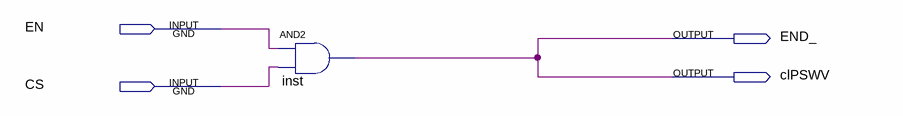
[diagram p0: schematic sheet]
// Quartus schematic CLV.bdf as structural Verilog: 1 symbols, 4 pins
module CLV (
  input  EN,
  input  CS,
  output END_,
  output clPSWV
);

  and inst (clPSWV, EN, CS);

  assign END_ = clPSWV;
endmodule
